# Altium schematic sheet Power.SchDoc
size A4; SheetNumber: 2; SheetTotal: 6; SPICEModelCacheCWKBOKIO: <root> / <DocumentId>CWKBOKIO</DocumentId> / <CacheFrame Number="0"> / <Model Name="860020572003_10uf" Kind="CKT"> / <Text>******* / .subckt 860020572003_10uF 1 2 / Rser 1 3 2.05181792146 / Lser 2 4 3.250120717E-09 / C1 3 4 0.00001 / Rpar 3 4 10000000 / .ends 860020572003_10uF</Text> / </Model> / <Model Name="3816_744031100_10u" Kind="CKT"> / <Text>******* / .subckt 3816_744031100_10u 1 2 / Rp 1 2 10770 / Cp 1 2 1.28p / Rs 1 N3 0.185 / L1 N3 2 10u / .ends 3816_744031100_10u</Text> / </Model> / </CacheFrame> / </root>
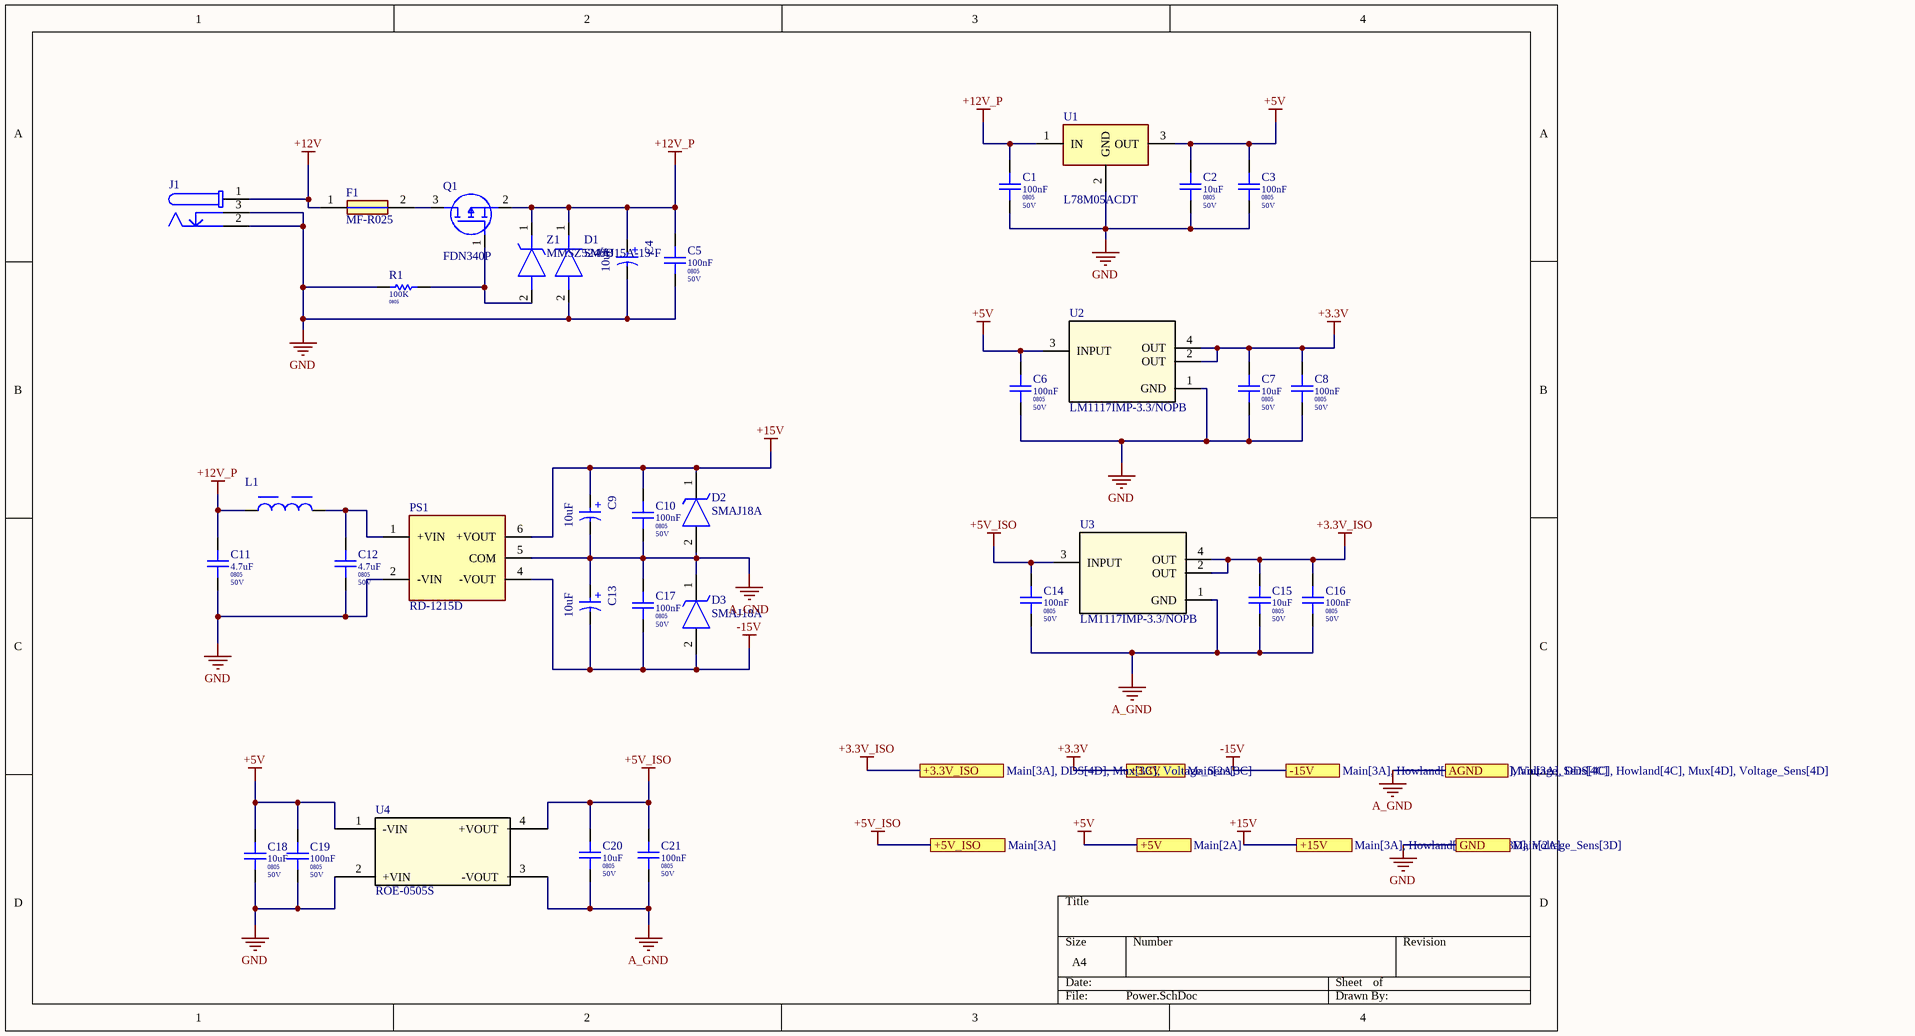
[diagram p0: Power.SchDoc]

## Parts
C1  Package / Case: 0805  Voltage: 50V  [CAPC 0805]  (hidden comment: 100nF)
C2  Package / Case: 0805  Voltage: 50V  [CAPC 0805]  (hidden comment: 10uF)
C3  Package / Case: 0805  Voltage: 50V  [CAPC 0805]  (hidden comment: 100nF)
C4  10uF  [WCAP-ATG5_D5H11]
C5  Package / Case: 0805  Voltage: 50V  [CAPC 0805]  (hidden comment: 100nF)
C6  Package / Case: 0805  Voltage: 50V  [CAPC 0805]  (hidden comment: 100nF)
C7  Package / Case: 0805  Voltage: 50V  [CAPC 0805]  (hidden comment: 10uF)
C8  Package / Case: 0805  Voltage: 50V  [CAPC 0805]  (hidden comment: 100nF)
C9  10uF  [WCAP-ATG5_D5H11]
C10  Package / Case: 0805  Voltage: 50V  [CAPC 0805]  (hidden comment: 100nF)
C11  Package / Case: 0805  Voltage: 50V  [CAPC 0805]  (hidden comment: 4.7uF)
C12  Package / Case: 0805  Voltage: 50V  [CAPC 0805]  (hidden comment: 4.7uF)
C13  10uF  [WCAP-ATG5_D5H11]
C14  Package / Case: 0805  Voltage: 50V  [CAPC 0805]  (hidden comment: 100nF)
C15  Package / Case: 0805  Voltage: 50V  [CAPC 0805]  (hidden comment: 10uF)
C16  Package / Case: 0805  Voltage: 50V  [CAPC 0805]  (hidden comment: 100nF)
C17  Package / Case: 0805  Voltage: 50V  [CAPC 0805]  (hidden comment: 100nF)
C18  Package / Case: 0805  Voltage: 50V  [CAPC 0805]  (hidden comment: 10uF)
C19  Package / Case: 0805  Voltage: 50V  [CAPC 0805]  (hidden comment: 100nF)
C20  Package / Case: 0805  Voltage: 50V  [CAPC 0805]  (hidden comment: 10uF)
C21  Package / Case: 0805  Voltage: 50V  [CAPC 0805]  (hidden comment: 100nF)
D1  SMAJ15A-13-F  [DIOM5226X240N]
D2  SMAJ18A  [DIOM5026X229N]
D3  SMAJ18A  [DIOM5026X229N]
F1  MF-R025  [MFR025]
J1  694106301002  [694106301002]  (value not drawn)
L1  10uH, 0.74A  [WE-TPC_3816]  (value not drawn)
PS1  RD-1215D  [RD1215D]
Q1  FDN340P  [SOT95P237X112-3N]
R1  Package / Case: 0805  [RESC 0805]  (hidden comment: 100K)
U1  L78M05ACDT  [L78M05ACDT]
U2  LM1117IMP-3.3/NOPB  [DCY0004A_M]
U3  LM1117IMP-3.3/NOPB  [DCY0004A_M]
U4  ROE-0505S  [ROE_RCP]
Z1  MMSZ5240B  [SOD3816X128N]

## Ports
+3.3V (see Main[2A]), +3.3V_ISO (see Main[3A], DDS[4D], Mux[3C], Voltage_Sens[3C]), +5V (see Main[2A]), +5V_ISO (see Main[3A]), +15V (see Main[3A], Howland[3D], Mux[3D], Voltage_Sens[3D]), -15V (see Main[3A], Howland[3C], Mux[4C], Voltage_Sens[4C]), AGND (see Main[3A], DDS[4C], Howland[4C], Mux[4D], Voltage_Sens[4D]), GND (see Main[2A])

## Nets
+3.3V: C7.2 C8.2 U2.2(OUT) U2.4(OUT) ; port +3.3V
+3.3V_ISO: C15.2 C16.2 U3.2(OUT) U3.4(OUT) ; port +3.3V_ISO
+5V: C2.2 C3.2 C6.2 C18.2 C19.2 U1.3(OUT) U2.3(INPUT) U4.1(-VIN) ; port +5V
+5V_ISO: C14.2 C20.2 C21.2 U3.3(INPUT) U4.4(+VOUT) ; port +5V_ISO
+12V: F1.1 J1.1
+12V_P: C1.2 C4.1(P) C5.2 C11.2 D1.1(K) L1.1 Q1.2(S) U1.1(IN) Z1.1(K)
+15V: C9.1(P) C10.2 D2.1(K) PS1.6(+VOUT) ; port +15V
-15V: C13.2(N) C17.1 D3.2(A) PS1.4(-VOUT) ; port -15V
A_GND: C9.2(N) C10.1 C13.1(P) C14.1 C15.1 C16.1 C17.2 C20.1 C21.1 D2.2(A) D3.1(K) PS1.5(COM) U3.1(GND) U4.3(-VOUT) ; port AGND
GND: C1.1 C2.1 C3.1 C4.2(N) C5.1 C6.1 C7.1 C8.1 C11.1 C12.1 C18.1 C19.1 D1.2(A) J1.2 J1.3 PS1.2(-VIN) R1.2 U1.2(GND) U2.1(GND) U4.2(+VIN) ; port GND
NetC12_2: C12.2 L1.2 PS1.1(+VIN)
NetF1_2: F1.2 Q1.3(D)
NetQ1_1: Q1.1(G) R1.1 Z1.2(A)

## Notes on the sheet
- (in symbol 860020572003) +

## Library data of the parts
C1 C3 C5 C6 C8 C10 C14 C16 C17 C19 C21 = CAPC0572: Capacitor Ceramic 100nF 50V 0805; Tolerance: %10; Value Rating: nF; Favorites: Favorite; Value: 100nF; Part Number: CAPC0572; Category: Capacitor Ceramic; Values: 100nF 50V
C2 C7 C15 C18 C20 = CAPC0588: Capacitor Ceramic 10uF 50V 0805; Tolerance: %10; Value Rating: uF; Value: 10uF; Part Number: CAPC0588; Category: Capacitor Ceramic; Values: 10uF 50V
C4 C9 C13 = 860020572003: WCAP-ATG5 Aluminum Electrolytic Capacitor, Radial, THT, D5 x H11mm, 10µF, 35V; Manufacturer: Wurth Elektronik; Capacitance Tolerance: +/-20%; Dissipation Factor: 12%; Endurance: 2000h; Leakage Current: 3.5uA; Ripple Current: 46mA; Technical Reference: ATDC110100M035DSPA3B000; Manufacturer Part Number: 860020572003; Category: Aluminum Electrolytic Capacitors; Match Code: WCAP-ATG5; ComponentLink1Description: Website Link; ComponentLink1URL: https://www.we-online.com/redexpert/article/860020572003?ad; ComponentLink2Description: Datasheet Link; ComponentLink2URL: https://www.we-online.com/redexpert/spec/860020572003?ad; Mount: Through Hole; Min Operating Temperature: -40°C; Max Operating Temperature: 105°C; Packaging: Ammo Pack; Height: 11mm; Diameter: 5mm; Capacitance: 10uF; Rated Voltage (DC): 35V
C11 C12 = CAPC0584: Capacitor Ceramic 4.7uF 50V 0805; Tolerance: %10; Value Rating: uF; Value: 4.7uF; Part Number: CAPC0584; Category: Capacitor Ceramic; Values: 4.7uF 50V
D1 = SMAJ15A-13-F: Diode; Manufacturer_Name: Diodes Incorporated; Datasheet Link: https://www.diodes.com/assets/Datasheets/ds19005.pdf; Height: 2.4mm; Manufacturer_Part_Number: SMAJ15A-13-F; Mouser Part Number: 621-SMAJ15A-13-F; Mouser Price/Stock: https://www.mouser.co.uk/ProductDetail/Diodes-Incorporated/SMAJ15A-13-F?qs=sxN%252BoM2fis%252B5%252BK6%2FciupkA%3D%3D; Arrow Part Number: SMAJ15A-13-F; Arrow Price/Stock: https://www.arrow.com/en/products/smaj15a-13-f/diodes-incorporated.html?utm_currency=USD&region=europe
D2 D3 = SMAJ18A: TVS Diode (Uni-directional); Manufacturer_Name: LITTELFUSE; Datasheet Link: https://www.littelfuse.com/~/media/electronics/datasheets/tvs_diodes/littelfuse_tvs_diode_smaj_datasheet.pdf.pdf; Height: 2.29mm; Manufacturer_Part_Number: SMAJ18A; Mouser Part Number: 576-SMAJ18A; Mouser Price/Stock: https://www.mouser.co.uk/ProductDetail/Littelfuse/SMAJ18A?qs=HR2RnyOI4E7wHW1lca9u5w%3D%3D; Arrow Part Number: SMAJ18A; Arrow Price/Stock: https://www.arrow.com/en/products/smaj18a/littelfuse?utm_currency=USD&region=nac
F1 = MF-R025: Fuse; Manufacturer_Name: Bourns; Datasheet Link: https://www.mouser.ph/datasheet/2/54/mf_r-777680.pdf; Height: 7.4mm; Manufacturer_Part_Number: MF-R025; Mouser Part Number: 652-MFR025; Mouser Price/Stock: https://www.mouser.co.uk/ProductDetail/Bourns/MF-R025?qs=NmEazmuVvbXTkonguszQtA%3D%3D; Arrow Part Number: MF-R025; Arrow Price/Stock: https://www.arrow.com/en/products/mf-r025/bourns?utm_currency=USD&region=nac
J1 = 694106301002: WR-DC Power Jack, THT, Right Angled, Center Pin 2mm, 5A, 30V (DC); Manufacturer: Wurth Elektronik; Plug Outer Diameter: 5.5mm; Manufacturer Part Number: 694106301002; Category: DC Power Jack Connector; Match Code: WR-DC; ComponentLink1Description: Website Link; ComponentLink1URL: https://www.we-online.com/redexpert/article/694106301002?ad; ComponentLink2Description: Datasheet Link; ComponentLink2URL: https://www.we-online.com/redexpert/spec/694106301002?ad; Mount: Through Hole; Min Operating Temperature: -40°C; Max Operating Temperature: 85°C; Packaging: Bag; Center Pin Diameter: 2mm; Orientation: Right Angled; Rated Current: 5A; Working Voltage: 30V (DC)
L1 = 744031100: WE-TPC SMT Tiny Power Inductor, size 3816, 10uH, 0.74A, 185mOhm; Manufacturer: Wurth Elektronik; Case/Size Code: 3816; Saturation Current: 0.56A; Self Resonant Frequency: 45MHz; Manufacturer Part Number: 744031100; Category: Power Inductors; Match Code: WE-TPC; ComponentLink1Description: Website Link; ComponentLink1URL: https://www.we-online.com/redexpert/article/744031100?ad; ComponentLink2Description: Datasheet Link; ComponentLink2URL: https://www.we-online.com/redexpert/spec/744031100?ad; Mount: Surface Mount; Min Operating Temperature: -40°C; Max Operating Temperature: 125°C; Packaging: Tape and Reel; Length: 3.8mm; Width: 3.8mm; Height: 1.65mm; DC Resistance: 185mOhm; Inductance: 10uH; Rated Current: 0.74A
PS1 = RD-1215D: Power Supply; Manufacturer_Name: RECOM Power; Datasheet Link: https://www.mouser.com/datasheet/2/468/RD-958126.pdf; Height: 10.7mm; Manufacturer_Part_Number: RD-1215D; Mouser Part Number: 919-RD-1215D; Mouser Price/Stock: https://www.mouser.co.uk/ProductDetail/RECOM-Power/RD-1215D?qs=XF8hdbuHJAUeGblPqJIAfA%3D%3D
Q1 = FDN340P: MOSFET (P-Channel); Manufacturer_Name: onsemi; Datasheet Link: https://www.onsemi.com/pub/Collateral/FDN340P-D.PDF; Height: 1.12mm; Manufacturer_Part_Number: FDN340P; Mouser Part Number: 512-FDN340P; Mouser Price/Stock: https://www.mouser.co.uk/ProductDetail/onsemi-Fairchild/FDN340P?qs=AMp2PTjoga9dhzFXRaqTZw%3D%3D; Arrow Part Number: FDN340P; Arrow Price/Stock: https://www.arrow.com/en/products/fdn340p/on-semiconductor?utm_currency=USD&region=nac
R1 = R0390: 100K 0805; Part Number: R0390; Tolerance: %5; Power: 1/10W; Value: 100K; Category: Resistor; Values: 100K
U1 = L78M05ACDT: Integrated Circuit; Manufacturer_Name: STMicroelectronics; Datasheet Link: https://componentsearchengine.com/Datasheets/2/L78M05ACDT.pdf; Height: 2.4mm; Manufacturer_Part_Number: L78M05ACDT; Mouser Part Number: 511-L78M05ACDT; Mouser Price/Stock: https://www.mouser.co.uk/ProductDetail/STMicroelectronics/L78M05ACDT?qs=y2nfjSRjEj0AoPOeCXWRuA%3D%3D
U2 U3 = LM1117IMP-3.3NOPB: 800-mA 15-V linear voltage regulator 4-SOT-223 -40 to 125; Manufacturer_Name: Texas Instruments; TYPE: TYPE; RefDes: RefDes; Copyright: Copyright (C) 2025 Ultra Librarian. All rights reserved.; Manufacturer_Part_Number: LM1117IMP-3.3/NOPB
U4 = ROE-0505S: Description; Manufacturer_Name: Recom Power; Copyright: Copyright (C) 2026 Ultra Librarian. All rights reserved.; Manufacturer_Part_Number: ROE-0505S; RefDes: RefDes; Type: Type
Z1 = MMSZ5240B: Zener Diode; Manufacturer_Name: onsemi; Datasheet Link: https://eu.mouser.com/datasheet/2/308/MMSZ5226B-1301377.pdf; Height: 1.28mm; Manufacturer_Part_Number: MMSZ5240B; Mouser Part Number: 512-MMSZ5240B; Mouser Price/Stock: https://www.mouser.co.uk/ProductDetail/onsemi-Fairchild/MMSZ5240B?qs=FITO%2F%2FQgYDlKkHnZqrmSpg%3D%3D; Arrow Part Number: MMSZ5240B; Arrow Price/Stock: https://www.arrow.com/en/products/mmsz5240b/on-semiconductor